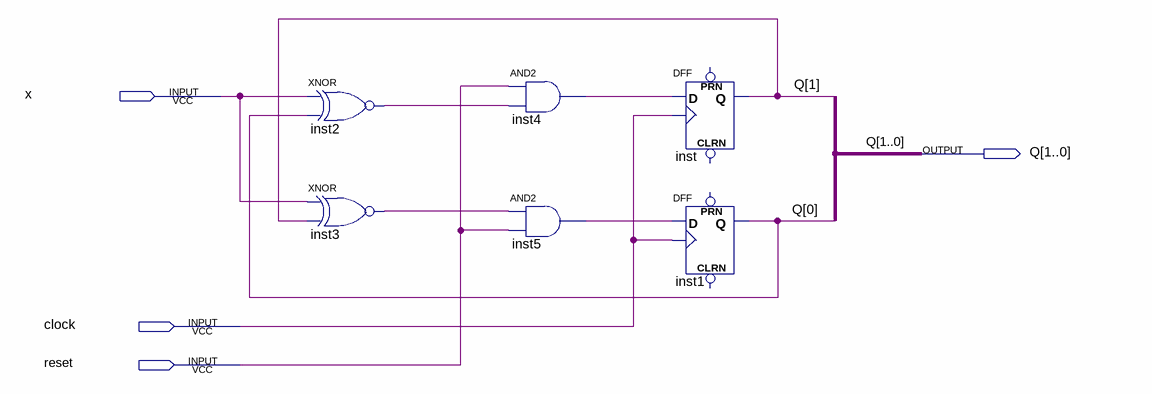
[diagram p0: schematic sheet]
// Quartus schematic MEF.bdf as structural Verilog: 6 symbols, 4 pins
module MEF (
  input  x,
  input  clock,
  input  reset,
  output [1:0] Q
);

  wire inst2_out, inst3_out, inst4_out, inst5_out;

  xnor inst2 (inst2_out, x, Q[0]);
  xnor inst3 (inst3_out, x, Q[1]);
  and inst4 (inst4_out, reset, inst2_out);
  and inst5 (inst5_out, inst3_out, reset);
  DFF inst (.CLK(clock), .D(inst4_out), .Q(Q[1]));  // open: CLRN, PRN
  DFF inst1 (.CLK(clock), .D(inst5_out), .Q(Q[0]));  // open: CLRN, PRN
endmodule
